# Altium schematic sheet Secondary_Power.SchDoc
size A3
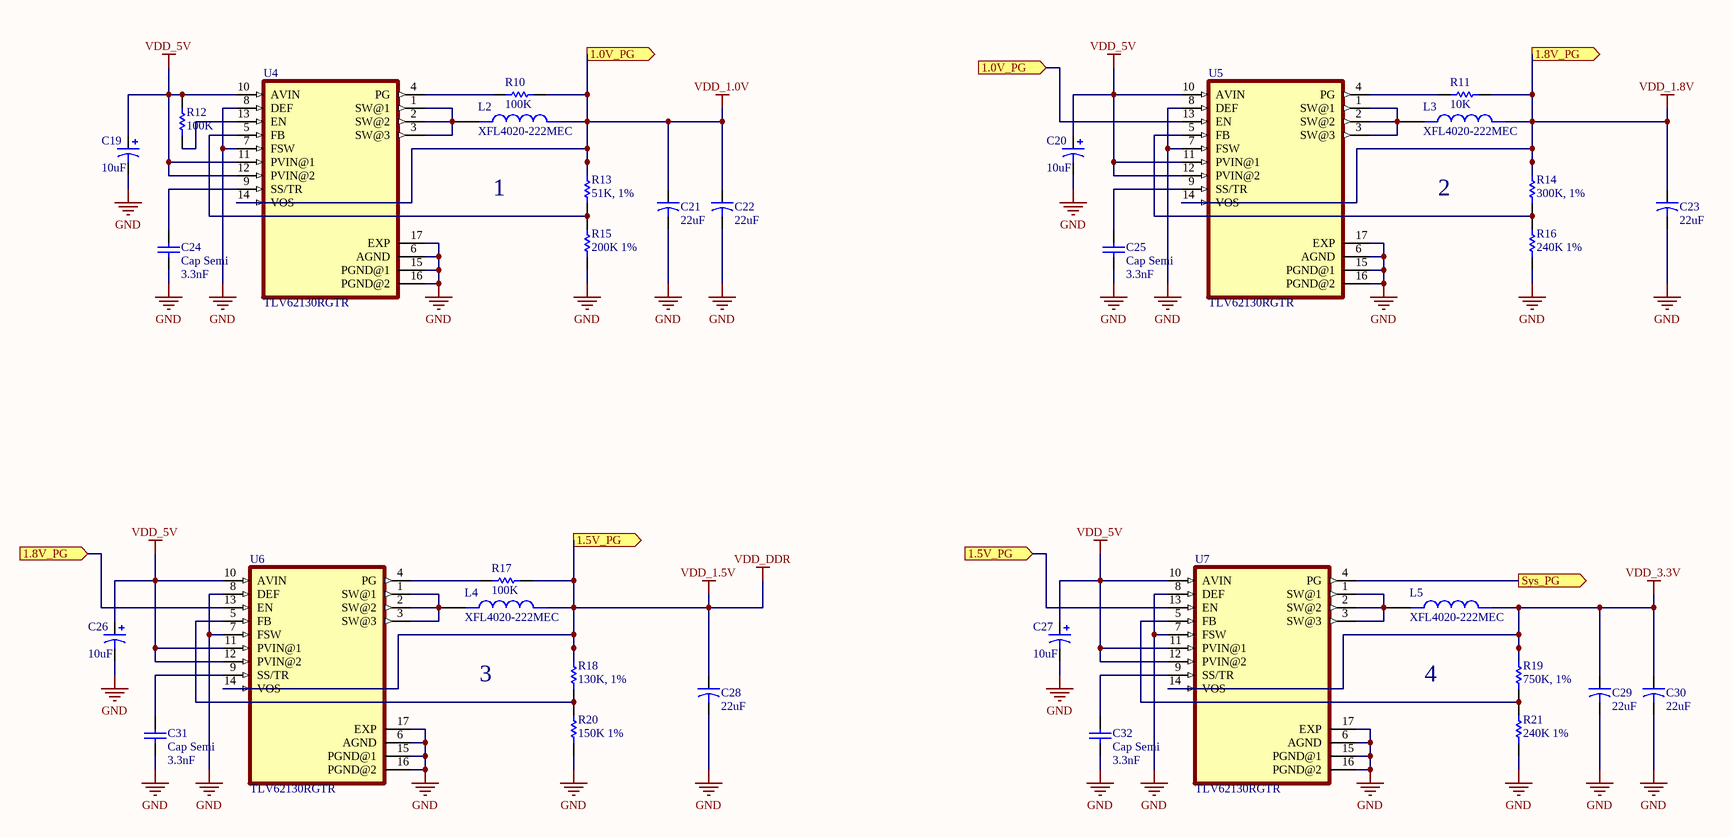
[diagram p0: Secondary_Power.SchDoc]

## Parts
C19  value 10uF  [C0805]  (hidden comment: Pol3)
C20  value 10uF  [C0805]  (hidden comment: Pol3)
C21  value 22uF  [1206 COND]  (hidden comment: 756-040)
C22  value 22uF  [1206 COND]  (hidden comment: 756-040)
C23  value 22uF  [1206 COND]  (hidden comment: 756-040)
C24  Cap Semi  value 3.3nF  [1608[0603]]
C25  Cap Semi  value 3.3nF  [1608[0603]]
C26  value 10uF  [C0805]  (hidden comment: Pol3)
C27  value 10uF  [C0805]  (hidden comment: Pol3)
C28  value 22uF  [1206 COND]  (hidden comment: 756-040)
C29  value 22uF  [1206 COND]  (hidden comment: 756-040)
C30  value 22uF  [1206 COND]  (hidden comment: 756-040)
C31  Cap Semi  value 3.3nF  [1608[0603]]
C32  Cap Semi  value 3.3nF  [1608[0603]]
L2  XFL4020-222MEC  [IND_XFL4020-222MEC]
L3  XFL4020-222MEC  [IND_XFL4020-222MEC]
L4  XFL4020-222MEC  [IND_XFL4020-222MEC]
L5  XFL4020-222MEC  [IND_XFL4020-222MEC]
R10  value 100K  [0603]  (hidden comment: Res1)
R11  value 10K  [0603]  (hidden comment: Res1)
R12  value 100K  [0603]  (hidden comment: Res1)
R13  value 51K, 1%  [0603]  (hidden comment: Res1)
R14  value 300K, 1%  [0603]  (hidden comment: Res1)
R15  value 200K 1%  [0603]  (hidden comment: Res1)
R16  value 240K 1%  [0603]  (hidden comment: Res1)
R17  value 100K  [0603]  (hidden comment: Res1)
R18  value 130K, 1%  [0603]  (hidden comment: Res1)
R19  value 750K, 1%  [0603]  (hidden comment: Res1)
R20  value 150K 1%  [0603]  (hidden comment: Res1)
R21  value 240K 1%  [0603]  (hidden comment: Res1)
U4  TLV62130RGTR  [QFN50P300X300X100-17N]
U5  TLV62130RGTR  [QFN50P300X300X100-17N]
U6  TLV62130RGTR  [QFN50P300X300X100-17N]
U7  TLV62130RGTR  [QFN50P300X300X100-17N]

## Ports
1.0V_PG (in), 1.0V_PG (out), 1.5V_PG (in), 1.5V_PG (out), 1.8V_PG (in), 1.8V_PG (out), Sys_PG (out)

## Nets
GND: C19.2 C20.2 C21.1 C22.1 C23.1 C24.1 C25.1 C26.2 C27.2 C28.1 C29.1 C30.1 C31.1 C32.1 R15.2 R16.2 R20.2 R21.2 U4.6(AGND) U4.7(FSW) U4.8(DEF) U4.15(PGND@1) U4.16(PGND@2) U4.17(EXP) U5.6(AGND) U5.7(FSW) U5.8(DEF) U5.15(PGND@1) U5.16(PGND@2) U5.17(EXP) U6.6(AGND) U6.7(FSW) U6.8(DEF) U6.15(PGND@1) U6.16(PGND@2) U6.17(EXP) U7.6(AGND) U7.7(FSW) U7.8(DEF) U7.15(PGND@1) U7.16(PGND@2) U7.17(EXP)
VDD_1.0V: C21.2 C22.2 L2.2 R10.1 R13.1 U4.14(VOS) U5.13(EN) ; port 1.0V_PG
VDD_1.5V: C28.2 L4.2 R17.1 R18.1 U6.14(VOS) U7.13(EN) ; port 1.5V_PG  [also labelled VDD_DDR]
VDD_1.8V: C23.2 L3.2 R11.1 R14.1 U5.14(VOS) U6.13(EN) ; port 1.8V_PG
VDD_3.3V: C29.2 C30.2 L5.2 R19.1 U7.14(VOS)
VDD_5V: C19.1 C20.1 C26.1 C27.1 R12.1 U4.10(AVIN) U4.11(PVIN@1) U4.12(PVIN@2) U5.10(AVIN) U5.11(PVIN@1) U5.12(PVIN@2) U6.10(AVIN) U6.11(PVIN@1) U6.12(PVIN@2) U7.10(AVIN) U7.11(PVIN@1) U7.12(PVIN@2)
Sys_PG: U7.4(PG) ; port Sys_PG
NetC24_2: C24.2 U4.9(SS/TR)
NetC25_2: C25.2 U5.9(SS/TR)
NetC31_2: C31.2 U6.9(SS/TR)
NetC32_2: C32.2 U7.9(SS/TR)
NetL2_1: L2.1 U4.1(SW@1) U4.2(SW@2) U4.3(SW@3)
NetL3_1: L3.1 U5.1(SW@1) U5.2(SW@2) U5.3(SW@3)
NetL4_1: L4.1 U6.1(SW@1) U6.2(SW@2) U6.3(SW@3)
NetL5_1: L5.1 U7.1(SW@1) U7.2(SW@2) U7.3(SW@3)
NetR10_2: R10.2 U4.4(PG)
NetR11_2: R11.2 U5.4(PG)
NetR12_2: R12.2 U4.13(EN)
NetR13_2: R13.2 R15.1 U4.5(FB)
NetR14_2: R14.2 R16.1 U5.5(FB)
NetR17_2: R17.2 U6.4(PG)
NetR18_2: R18.2 R20.1 U6.5(FB)
NetR19_2: R19.2 R21.1 U7.5(FB)

## Notes on the sheet
- 1
- 2
- 3
- 4

## Library data of the parts
C19 C20 C26 C27 = Cap Pol3: Polarized Capacitor (Surface Mount); Published: 8-Jun-2000; LatestRevisionDate: 29-May-2009; LatestRevisionNote: IPC-7351 Footprint Added.; PackageReference: C0805; Publisher: Altium Limited; PackageDescription: Chip Capacitor
C21-C23 C28-C30 = Cap2_1: Capacitor; Manufacturer: Generic Components; Class I: Passive; Published: 23-Sep-2002; Publisher: Altium Limited; Class II: Capacitor
C24 C25 C31 C32 = Cap Semi: Capacitor (Semiconductor SIM Model); Published: 8-Jun-2000; LatestRevisionDate: 29-May-2009; LatestRevisionNote: IPC-7351 Footprint Added.; PackageReference: C1206; Publisher: Altium Limited; PackageDescription: Chip Capacitor
L2-L5 = XFL4020-222MEC: Power inductor, shielded, 20% tol, SMT, RoHS, halogen free; MF: Coilcraft; Package: None; Mouser-Purchase-URL: https://snapeda.com/shop?store=Mouser&id=111458; Price: None; Availability: Warning; MP: XFL4020-222MEC; SnapEDA_Link: https://www.snapeda.com/parts/XFL4020-222MEC/Coilcraft/view-part/111458/?ref=snap; Value: *
R10-R21 = Res1_1: Resistor; Manufacturer: Generic Components; Class I: Passive; Published: 8-Jun-2000; Revision: July-2002: Re-released for DXP Platform.; Publisher: Altium Limited; Class II: Resistor; REF FARNELL 1206 SMD 510R: 4387065; REF FARNELL 1206 SMD 1K: 912475; REF FARNELL 1206 SMD 10K: 912591; REF FARNELL 0603 SMD: 612-595
U4-U7 = TLV62130RGTR: 3-17V 3A Step-Down Converter in 3x3 QFN Package 16-VQFN -40 to 85; MF: Texas Instruments; Mouser-Purchase-URL: https://snapeda.com/shop?store=Mouser&id=423292; MP: TLV62130RGTR; Value: *; DigiKey-Purchase-URL: https://snapeda.com/shop?store=DigiKey&id=423292; Package: VQFN-16 Texas Instruments; Texas_Instruments-Purchase-URL: https://snapeda.com/shop?store=Texas+Instruments&id=423292; Price: None; Availability: Unavailable; SnapEDA_Link: https://www.snapeda.com/parts/TLV62130RGTR/Texas%20Instruments/view-part/423292/?ref=snap